# Altium schematic sheet Flight_Controller.SchDoc
size A3; SheetNumber: 1; SheetTotal: 1
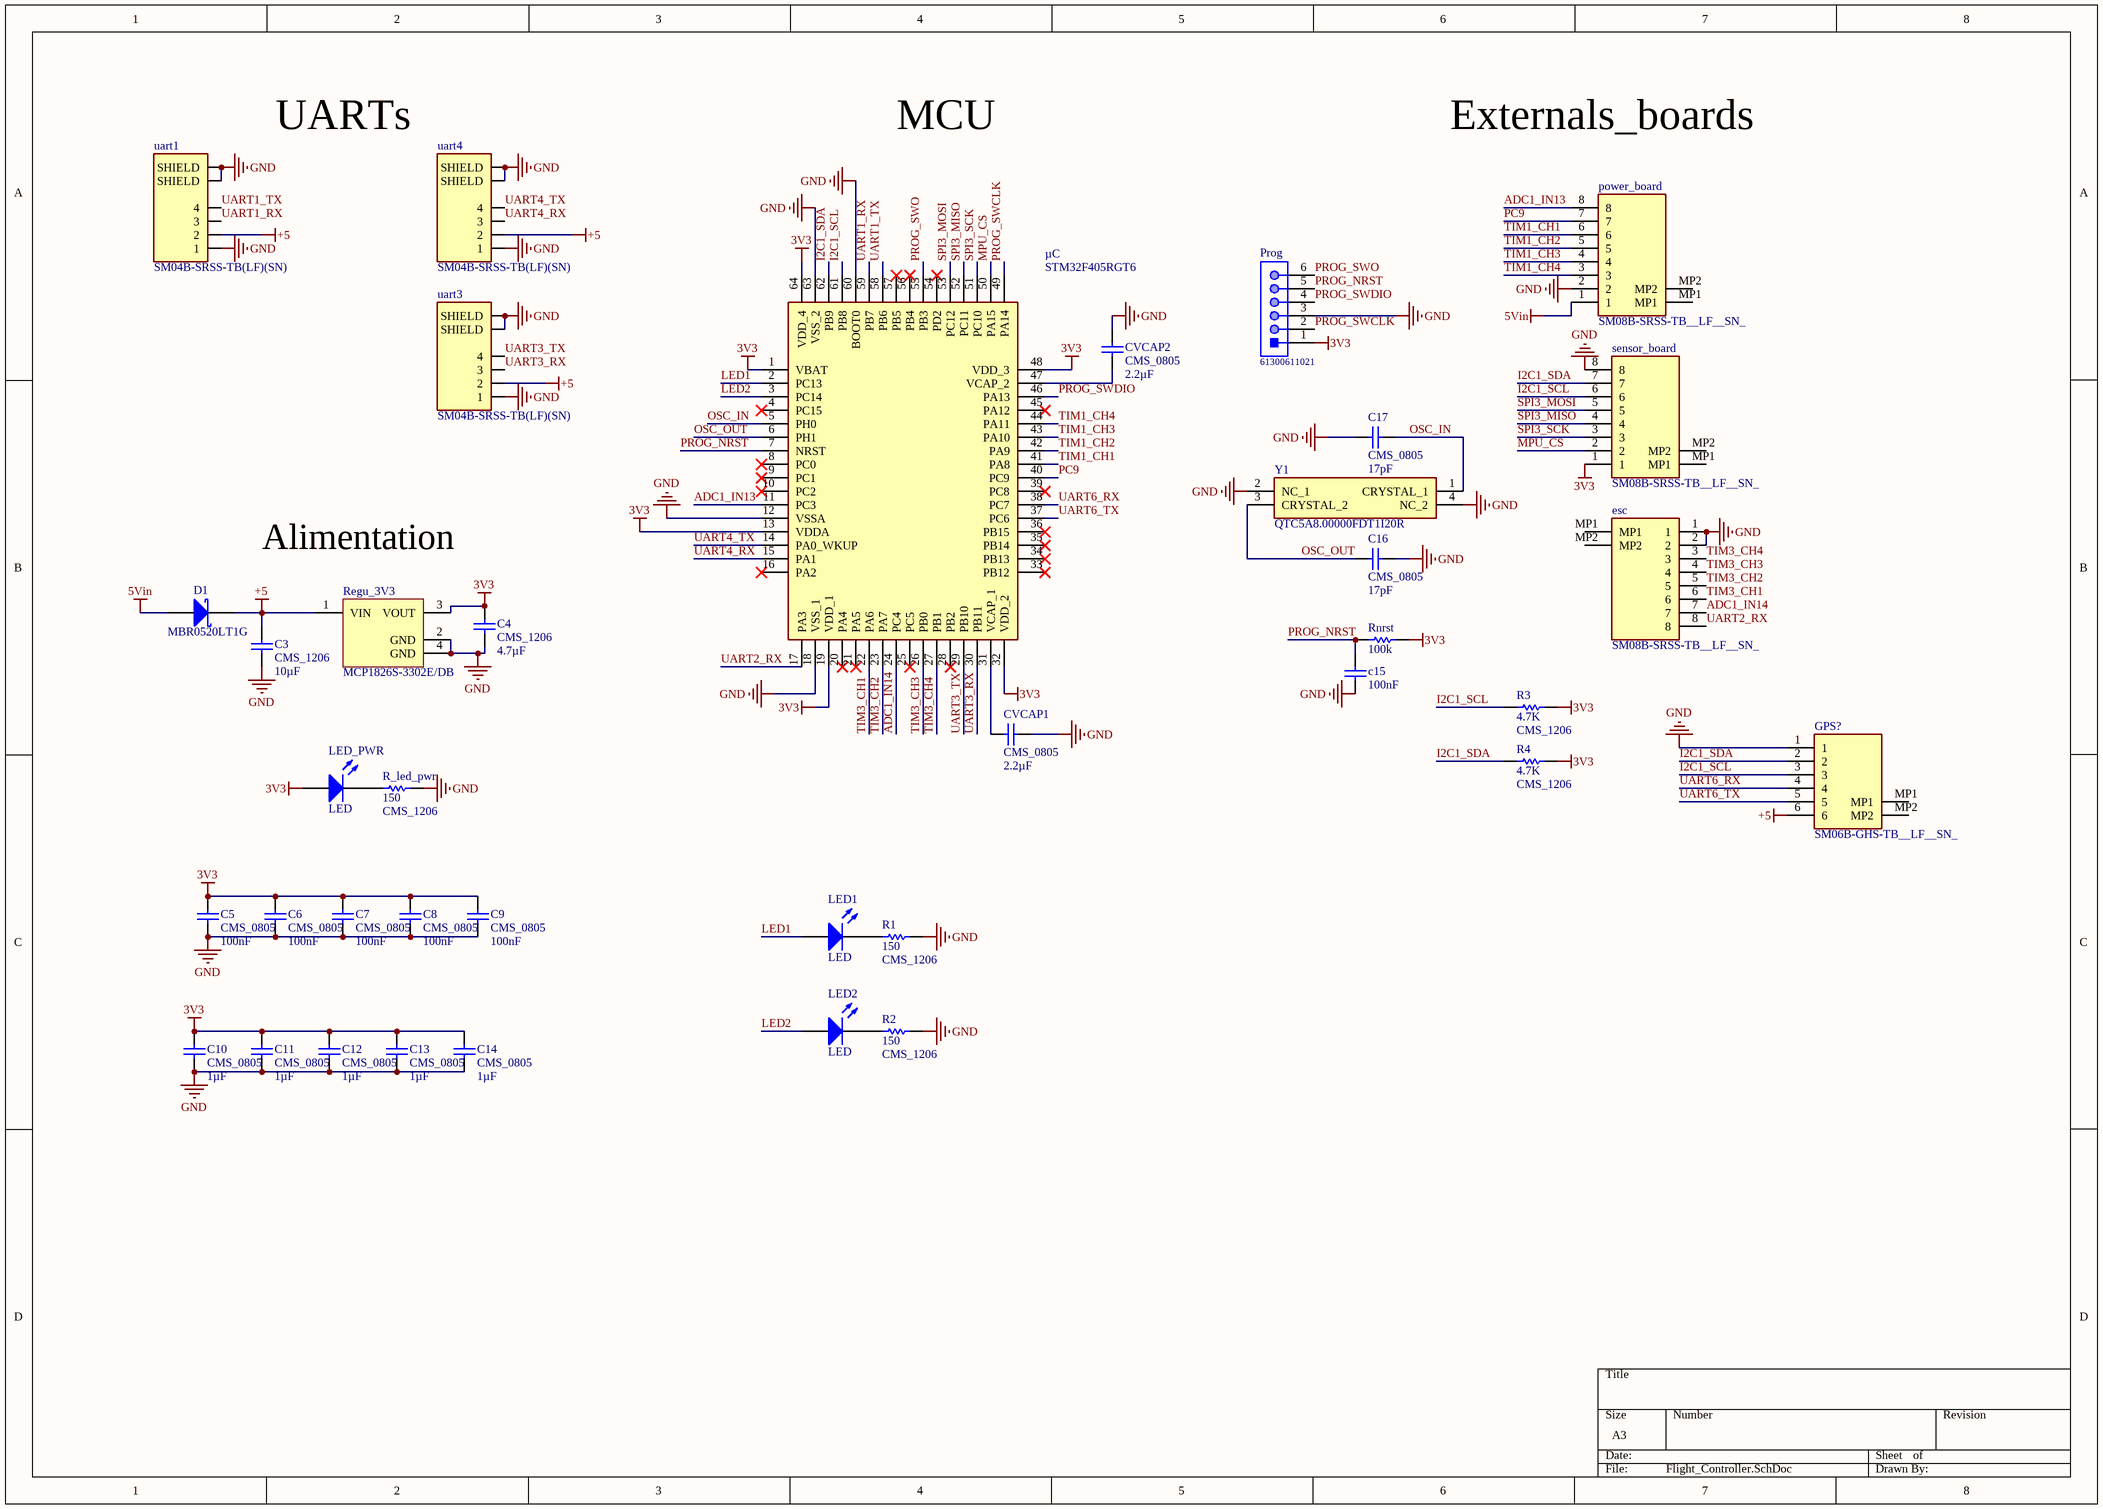
[diagram p0: Flight_Controller.SchDoc]

## Parts
C3  value 10µF  [CONDENSATEUR_CMS_1206]  (hidden comment: CMS_1206)
C4  value 4.7µF  [CONDENSATEUR_CMS_1206]  (hidden comment: CMS_1206)
C5  value 100nF  [CONDENSATEUR_CMS_0805]  (hidden comment: CMS_0805)
C6  value 100nF  [CONDENSATEUR_CMS_0805]  (hidden comment: CMS_0805)
C7  value 100nF  [CONDENSATEUR_CMS_0805]  (hidden comment: CMS_0805)
C8  value 100nF  [CONDENSATEUR_CMS_0805]  (hidden comment: CMS_0805)
C9  value 100nF  [CONDENSATEUR_CMS_0805]  (hidden comment: CMS_0805)
C10  value 1µF  [CONDENSATEUR_CMS_0805]  (hidden comment: CMS_0805)
C11  value 1µF  [CONDENSATEUR_CMS_0805]  (hidden comment: CMS_0805)
C12  value 1µF  [CONDENSATEUR_CMS_0805]  (hidden comment: CMS_0805)
C13  value 1µF  [CONDENSATEUR_CMS_0805]  (hidden comment: CMS_0805)
C14  value 1µF  [CONDENSATEUR_CMS_0805]  (hidden comment: CMS_0805)
c15  100nF  [C0805_N]
C16  value 17pF  [CONDENSATEUR_CMS_0805]  (hidden comment: CMS_0805)
C17  value 17pF  [CONDENSATEUR_CMS_0805]  (hidden comment: CMS_0805)
CVCAP1  value 2.2µF  [CONDENSATEUR_CMS_0805]  (hidden comment: CMS_0805)
CVCAP2  value 2.2µF  [CONDENSATEUR_CMS_0805]  (hidden comment: CMS_0805)
D1  MBR0520LT1G  [ONSC-SOD-123-2-425-04_V]
esc  SM08B-SRSS-TB__LF__SN_  [SM08BSRSSTBLFSN]
GPS?  SM06B-GHS-TB__LF__SN_  [SM06BGHSTBLFSN]
LED1  LED  [LED_1206]
LED2  LED  [LED_1206]
LED_PWR  LED  [LED_1206]
power_board  SM08B-SRSS-TB__LF__SN_  [SM08BSRSSTBLFSN]
Prog  61300611021  [61300611021]
R1  value 150  Type: CMS_1206  [RESISTANCE_CMS_1206]  (hidden comment: RESISTANCE_CMS_1206)
R2  value 150  Type: CMS_1206  [RESISTANCE_CMS_1206]  (hidden comment: RESISTANCE_CMS_1206)
R3  value 4.7K  Type: CMS_1206  [RESISTANCE_CMS_1206]  (hidden comment: RESISTANCE_CMS_1206)
R4  value 4.7K  Type: CMS_1206  [RESISTANCE_CMS_1206]  (hidden comment: RESISTANCE_CMS_1206)
R_led_pwr  value 150  Type: CMS_1206  [RESISTANCE_CMS_1206]  (hidden comment: RESISTANCE_CMS_1206)
Regu_3V3  MCP1826S-3302E/DB  [SOT-223-DB3_L]
Rnrst  100k  [R1206_N]
sensor_board  SM08B-SRSS-TB__LF__SN_  [SM08BSRSSTBLFSN]
uart1  SM04B-SRSS-TB(LF)(SN)  [JST_SM04B-SRSS-TB(LF)(SN)]
uart3  SM04B-SRSS-TB(LF)(SN)  [JST_SM04B-SRSS-TB(LF)(SN)]
uart4  SM04B-SRSS-TB(LF)(SN)  [JST_SM04B-SRSS-TB(LF)(SN)]
Y1  QTC5A8.00000FDT1I20R  [QTC5A800000FDT1I20R]
µC  STM32F405RGT6  [QFP50P1200X1200X160-64N]

## Nets
3V3: C4.2 C5.1 C6.1 C7.1 C8.1 C9.1 C10.1 C11.1 C12.1 C13.1 C14.1 LED_PWR.1(A) Prog.1 R3.2 R4.2 Regu_3V3.3(VOUT) Rnrst.2 sensor_board.1 µC.1(VBAT) µC.13(VDDA) µC.19(VDD_1) µC.32(VDD_2) µC.48(VDD_3) µC.64(VDD_4)
5Vin: D1.1(A) power_board.1
+5: C3.2 D1.2(K) GPS?.6 Regu_3V3.1(VIN) uart1.2 uart3.2 uart4.2
GND: C3.1 C4.1 C5.2 C6.2 C7.2 C8.2 C9.2 C10.2 C11.2 C12.2 C13.2 C14.2 c15.1 C16.2 C17.2 CVCAP1.1 CVCAP2.1 esc.1 esc.2 GPS?.1 power_board.2 Prog.3 R1.2 R2.2 R_led_pwr.2 Regu_3V3.2(GND) Regu_3V3.4(GND) sensor_board.8 uart1.1 uart1.S1(SHIELD) uart1.S2(SHIELD) uart3.1 uart3.S1(SHIELD) uart3.S2(SHIELD) uart4.1 uart4.S1(SHIELD) uart4.S2(SHIELD) Y1.2(NC_1) Y1.4(NC_2) µC.12(VSSA) µC.18(VSS_1) µC.60(BOOT0) µC.63(VSS_2)
ADC1_IN13: power_board.8 µC.11(PC3)
ADC1_IN14: esc.7 µC.24(PC4)
I2C1_SCL: GPS?.3 R3.1 sensor_board.6 µC.61(PB8)
I2C1_SDA: GPS?.2 R4.1 sensor_board.7 µC.62(PB9)
LED1: LED1.1(A) µC.2(PC13)
LED2: LED2.1(A) µC.3(PC14)
MPU_CS: sensor_board.2 µC.50(PA15)
OSC_IN: C17.1 Y1.1(CRYSTAL_1) µC.5(PH0)
OSC_OUT: C16.1 Y1.3(CRYSTAL_2) µC.6(PH1)
PC9: power_board.7 µC.40(PC9)
PROG_NRST: c15.2 Prog.5 Rnrst.1 µC.7(NRST)
PROG_SWCLK: Prog.2 µC.49(PA14)
PROG_SWDIO: Prog.4 µC.46(PA13)
PROG_SWO: Prog.6 µC.55(PB3)
SPI3_MISO: sensor_board.4 µC.52(PC11)
SPI3_MOSI: sensor_board.5 µC.53(PC12)
SPI3_SCK: sensor_board.3 µC.51(PC10)
TIM1_CH1: power_board.6 µC.41(PA8)
TIM1_CH2: power_board.5 µC.42(PA9)
TIM1_CH3: power_board.4 µC.43(PA10)
TIM1_CH4: power_board.3 µC.44(PA11)
TIM3_CH1: esc.6 µC.22(PA6)
TIM3_CH2: esc.5 µC.23(PA7)
TIM3_CH3: esc.4 µC.26(PB0)
TIM3_CH4: esc.3 µC.27(PB1)
UART1_RX: uart1.3 µC.59(PB7)
UART1_TX: uart1.4 µC.58(PB6)
UART2_RX: esc.8 µC.17(PA3)
UART3_RX: uart3.3 µC.30(PB11)
UART3_TX: uart3.4 µC.29(PB10)
UART4_RX: uart4.3 µC.15(PA1)
UART4_TX: uart4.4 µC.14(PA0_WKUP)
UART6_RX: GPS?.4 µC.38(PC7)
UART6_TX: GPS?.5 µC.37(PC6)
NetCVCAP1_2: CVCAP1.2 µC.31(VCAP_1)
NetCVCAP2_2: CVCAP2.2 µC.47(VCAP_2)
NetLED1_2: LED1.2(K) R1.1
NetLED2_2: LED2.2(K) R2.1
NetLED_PWR_2: LED_PWR.2(K) R_led_pwr.1

Not connected (* = marked no-connect by the designer): esc MP1 MP2; GPS? MP1 MP2; power_board MP1 MP2; sensor_board MP1 MP2; µC 4(PC15)* 8(PC0)* 9(PC1)* 10(PC2)* 16(PA2)* 20(PA4)* 21(PA5)* 25(PC5)* 28(PB2)* 33(PB12)* 34(PB13)* 35(PB14)* 36(PB15)* 39(PC8)* 45(PA12)* 54(PD2)* 56(PB4)* 57(PB5)*

## Notes on the sheet
- UARTs
- MCU
- Externals_boards
- Alimentation

## Library data of the parts
C3 C4 = CONDENSATEUR_CMS_CER_1206: CONDENSATEUR CMS CERAMIQUE 1206; Type: CMS_1206
C5-C14 C16 C17 CVCAP1 CVCAP2 = CONDENSATEUR_CMS_CER_0805: CONDENSATEUR CMS CERAMIQUE 0805; Type: CMS_0805
c15 = Condensateur: Capacitor; Published: 8-Jun-2000; LatestRevisionDate: 17-Jul-2002; LatestRevisionNote: Re-released for DXP Platform.; PackageReference: RAD-0.3; Publisher: Altium Limited
D1 = CMP-004-00003-1: Schottky Power Rectifier, 20 V, 5.5 A, -65 to 125 degC, 2-Pin SMD, RoHS, Tape and Reel; Manufacturer: ON Semiconductor; Peak Reverse Current: 250uA; Max Surge Current: 5.5A; Forward Voltage: 3.85dV; Forward Current: 5dA; Elements: 1; Datasheet Version: Rev. 6, 01/2012; Max Operating Temperature: 125°C; RoHS Compliant: True; Manufacturer URL: http://www.onsemi.com/; Packaging: TapeandReel; Datasheet URL: http://www.onsemi.cn/pub_link/Collateral/MBR0520LT1-D.PDF; Package Reference: SOD-123-2-425-04; Package Quantity: 3000; Min Operating Temperature: -65°C; Mounting Technology: SM; Package Description: 2-Pin Surface Mount Device, Body 2.69 x 1.6 mm; Case/Package: SOD; Pins: 2
esc power_board sensor_board = SM08B-SRSS-TB__LF__SN_: Connector; Manufacturer_Name: JST (JAPAN SOLDERLESS TERMINALS); Manufacturer_Part_Number: SM08B-SRSS-TB (LF)(SN); Datasheet Link: http://docs-emea.rs-online.com/webdocs/082f/0900766b8082f545.pdf; Height: 2.9mm; Arrow Part Number: SM08B-SRSS-TB (LF)(SN); Arrow Price/Stock: https://www.arrow.com/en/products/sm08b-srss-tb-lf-sn/jst-manufacturing
GPS? = SM06B-GHS-TB__LF__SN_: Connector; Manufacturer_Name: JST (JAPAN SOLDERLESS TERMINALS); Manufacturer_Part_Number: SM06B-GHS-TB (LF)(SN); Datasheet Link: http://www.jst-mfg.com/product/pdf/eng/eGH.pdf; Height: 4.25mm; Arrow Part Number: SM06B-GHS-TB (LF)(SN); Arrow Price/Stock: https://www.arrow.com/en/products/sm06b-ghs-tb-lf-sn/jst-manufacturing
LED1 LED2 LED_PWR = LED: Typical LED; Published: 8-Jun-2000; LatestRevisionDate: 08-Jul-2005; LatestRevisionNote: Mech Layer 1 removed.; PackageReference: LED-1; Publisher: Altium Limited
Prog = CMP-1502-01069-1: THT Angled Pin Header WR-PHD, Pitch 2.54 mm, Single Row, 6 pins; Manufacturer: Wurth Elektronik; Pin Number: 6; Gender: Male; Withstanding Voltage: 500VAC; Rated Current: 3A; Working Voltage: 250VAC; Contact Resistance: 20mOhm; Pitch: 2.54mm; Operating Temperature: -40to105degC; Package Reference: 61300611021; Packaging: Bag; Orientation: Angled; Manufacturer URL: http://www.we-online.de; Datasheet URL: https://katalog.we-online.de/em/datasheet/6130xx11021.pdf; Mounting Technology: THT; Publisher: WurthElektronik; Row Number: Single; Part Number: 61300611021
R1-R4 R_led_pwr = RESISTANCE_CMS_1206: RESISTANCE CMS 1206
Regu_3V3 = CMP-0136-00504-1: 1000 mA, Low Voltage, Low Quiescent Current LDO Regulator, 3-Pin SOT-223, Extended Temperature; PackageVersion: revBB, Aug-2009; PackageReference: SOT-223-DB3; DatasheetVersion: revA, Aug-2007; PackageDescription: 3-Lead Plastic Small Outline Transistor (DB) [SOT-223]
Rnrst = Resistor: Published: 8-Jun-2000; LatestRevisionDate: 17-Jul-2002; LatestRevisionNote: Re-released for DXP Platform.; PackageReference: AXIAL-0.5; Publisher: Altium Limited
uart1 uart3 uart4 = SM04B-SRSS-TB(LF)(SN): Connector Header Surface Mount, Right Angle 4 position 0.039 _1.00mm_; MF: JST Sales; MP: SM04B-SRSS-TB_LF__SN_; Price: None; SnapEDA_Link: https://www.snapeda.com/parts/SM04B-SRSS-TB%28LF%29%28SN%29/JST%20Sales%20America%20Inc./view-part/557466/?ref=snap; Value: *; Availability: Unavailable; Package: None
Y1 = QTC5A8.00000FDT1I20R: Crystal or Oscillator; Manufacturer_Name: QT Quarztechnik; Datasheet Link: https://docs-emea.rs-online.com/webdocs/12f2/0900766b812f2b81.pdf; Height: 0.8mm; Manufacturer_Part_Number: QTC5A8.00000FDT1I20R
µC = STM32F405RGT6: Integrated Circuit; Manufacturer_Name: STMicroelectronics; Datasheet Link: http://www.st.com/web/en/resource/technical/document/datasheet/DM00037051.pdf; Height: 1.6mm; Manufacturer_Part_Number: STM32F405RGT6; Mouser Part Number: 511-STM32F405RGT6; Mouser Price/Stock: https://www.mouser.co.uk/ProductDetail/STMicroelectronics/STM32F405RGT6?qs=Z8%252BeY1k3TIKgj7QWsYGpQw%3D%3D; Arrow Part Number: STM32F405RGT6; Arrow Price/Stock: https://www.arrow.com/en/products/stm32f405rgt6/stmicroelectronics?region=nac